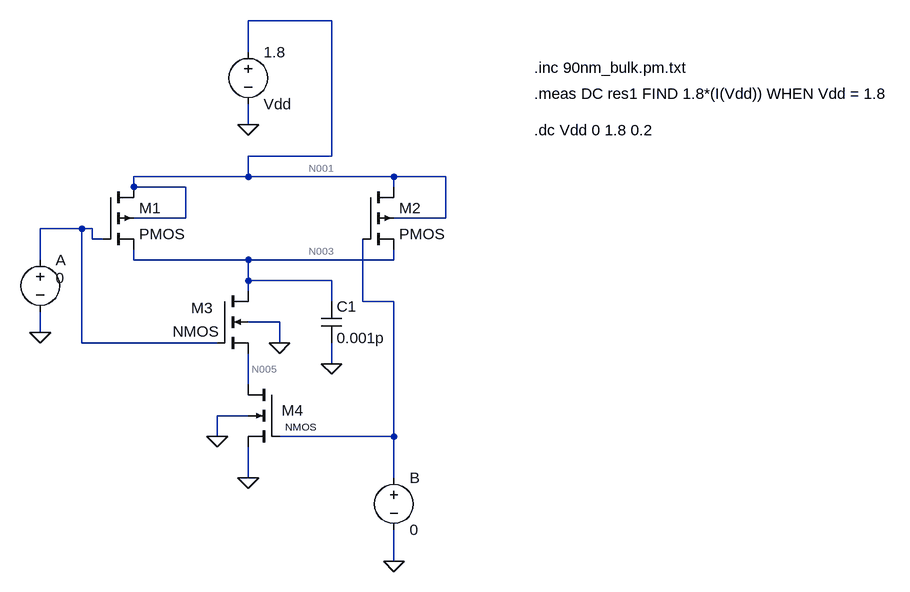
[diagram p0: schematic conventional nand.asc]
conventional nand.asc, the LTspice schematic file:
Version 4
SHEET 1 1252 680
WIRE 352 -192 224 -192
WIRE 224 -144 224 -192
WIRE 224 -32 224 -64
WIRE 352 16 352 -192
WIRE 352 16 224 16
WIRE 224 48 224 16
WIRE 224 48 48 48
WIRE 448 48 224 48
WIRE 528 48 448 48
WIRE 48 64 48 48
WIRE 128 64 48 64
WIRE 448 64 448 48
WIRE 128 112 128 64
WIRE 128 112 48 112
WIRE 528 112 528 48
WIRE 528 112 448 112
WIRE -32 128 -96 128
WIRE -16 128 -32 128
WIRE -16 144 -16 128
WIRE 0 144 -16 144
WIRE -96 176 -96 128
WIRE 48 176 48 160
WIRE 224 176 48 176
WIRE 448 176 448 160
WIRE 448 176 224 176
WIRE 224 208 224 176
WIRE 352 208 224 208
WIRE 224 224 224 208
WIRE 352 240 352 208
WIRE 400 240 400 144
WIRE 448 240 400 240
WIRE 272 272 224 272
WIRE -96 288 -96 256
WIRE -32 304 -32 128
WIRE 176 304 -32 304
WIRE 272 304 272 272
WIRE 352 336 352 304
WIRE 224 368 224 320
WIRE 224 416 176 416
WIRE 176 448 176 416
WIRE 448 448 448 240
WIRE 448 448 272 448
WIRE 224 512 224 464
WIRE 448 512 448 448
WIRE 448 640 448 592
FLAG 352 336 0
FLAG -96 288 0
FLAG 224 -32 0
FLAG 272 304 0
FLAG 224 512 0
FLAG 448 640 0
FLAG 176 448 0
SYMBOL voltage 224 -160 R0
WINDOW 0 24 96 Left 2
WINDOW 3 24 16 Left 2
WINDOW 123 0 0 Left 0
WINDOW 39 0 0 Left 0
SYMATTR InstName Vdd
SYMATTR Value 1.8
SYMBOL pmos4 0 64 R0
SYMATTR InstName M1
SYMATTR Value2 l=90n w=400n
SYMBOL pmos4 400 64 R0
SYMATTR InstName M2
SYMATTR Value2 l=90n w=400n
SYMBOL nmos4 176 224 R0
WINDOW 0 -40 26 Left 2
WINDOW 3 -68 62 Left 2
SYMATTR InstName M3
SYMATTR Value2 l=90n w=100n
SYMBOL nmos4 272 368 M0
WINDOW 0 -20 40 Center 2
WINDOW 3 -33 55 Top 1
SYMATTR InstName M4
SYMATTR Value2 l=90n w=100n
SYMBOL cap 336 240 R0
SYMATTR InstName C1
SYMATTR Value 0.001p
SYMBOL voltage -96 160 R0
WINDOW 3 24 44 Left 2
WINDOW 123 0 0 Left 0
WINDOW 39 0 0 Left 0
SYMATTR Value 0
SYMATTR InstName A
SYMBOL voltage 448 496 R0
WINDOW 123 0 0 Left 0
WINDOW 39 0 0 Left 0
SYMATTR InstName B
SYMATTR Value 0
TEXT 664 -120 Left 2 !.inc 90nm_bulk.pm.txt
TEXT 664 -80 Left 2 !.meas DC res1 FIND 1.8*(I(Vdd)) WHEN Vdd = 1.8
TEXT 664 -24 Left 2 !.dc Vdd 0 1.8 0.2

The netlist it stands for:
* conventional nand.asc
Vdd N001 0 1.8
M1 N001 N002 N003 N001 PMOS l=90n w=400n
M2 N001 N004 N003 N001 PMOS l=90n w=400n
M3 N003 N002 N005 0 NMOS l=90n w=100n
M4 N005 N004 0 0 NMOS l=90n w=100n
C1 N003 0 0.001p
V§A N002 0 0
V§B N004 0 0
.model NMOS NMOS
.model PMOS PMOS
.lib standard.mos
.inc 90nm_bulk.pm.txt
.meas DC res1 FIND 1.8*(I(Vdd)) WHEN Vdd = 1.8
.dc Vdd 0 1.8 0.2
.backanno
.end

* Results of the author's LTspice run, read from the files saved beside the schematic
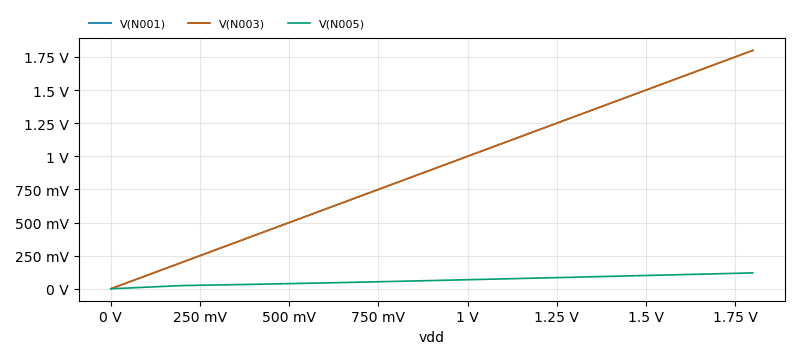
[diagram p1: DC transfer characteristic of conventional nand.asc, plotted from the saved traces]
* DC transfer characteristic, 1 run:
*   V(N001): 0 V at vdd=0 V, 1.8 V at vdd=1.8 V, min 0 V, max 1.8 V
*   V(N003): 0 V at vdd=0 V, 1.8 V at vdd=1.8 V, min 0 V, max 1.8 V
*   V(N005): 0 V at vdd=0 V, 120.1 mV at vdd=1.8 V, min 0 V, max 120.1 mV
* From the log:
*   res1: 1.8*(i(vdd))=-2.95392e-008 at 1.8